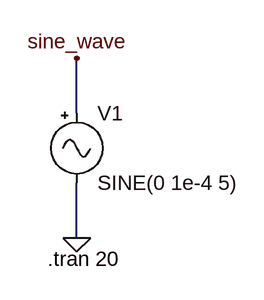
[diagram p0: schematic initial_simulation.asc]
initial_simulation.asc, the LTspice schematic file:
Version 4
SHEET 1 880 680
WIRE 48 96 48 32
WIRE 48 240 48 176
FLAG 48 240 0
FLAG 48 32 sine_wave
SYMBOL Misc\\signal 48 80 R0
WINDOW 123 0 0 Left 0
WINDOW 39 0 0 Left 0
SYMATTR InstName V1
SYMATTR Value SINE(0 1e-4 5)
TEXT 14 264 Left 2 !.tran 20

The netlist it stands for:
* initial_simulation.asc
V1 sine_wave 0 SINE(0 1e-4 5)
.tran 20
.backanno
.end